# EAGLE board VSCard_v4 (EAGLE 8.3.1)
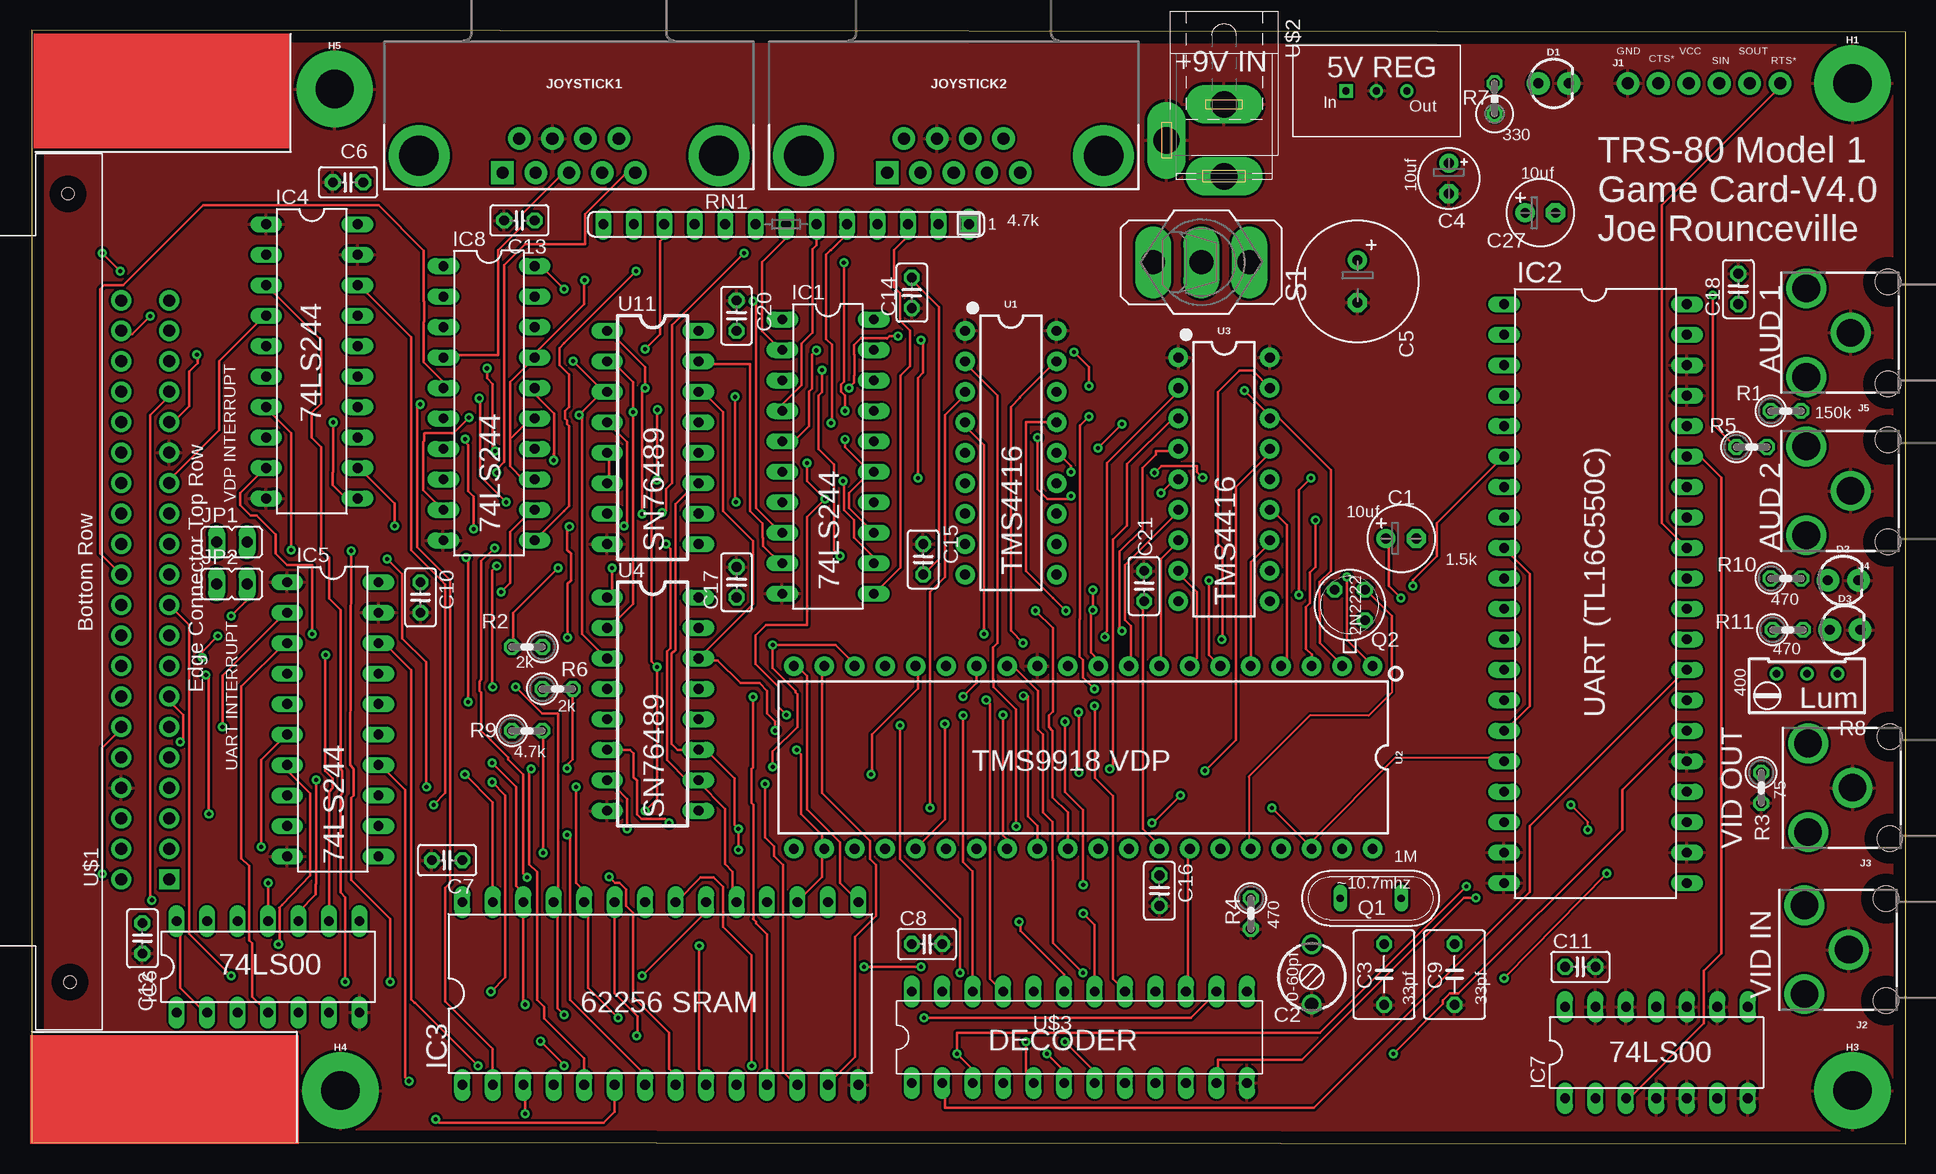
[diagram p2: board, top side]
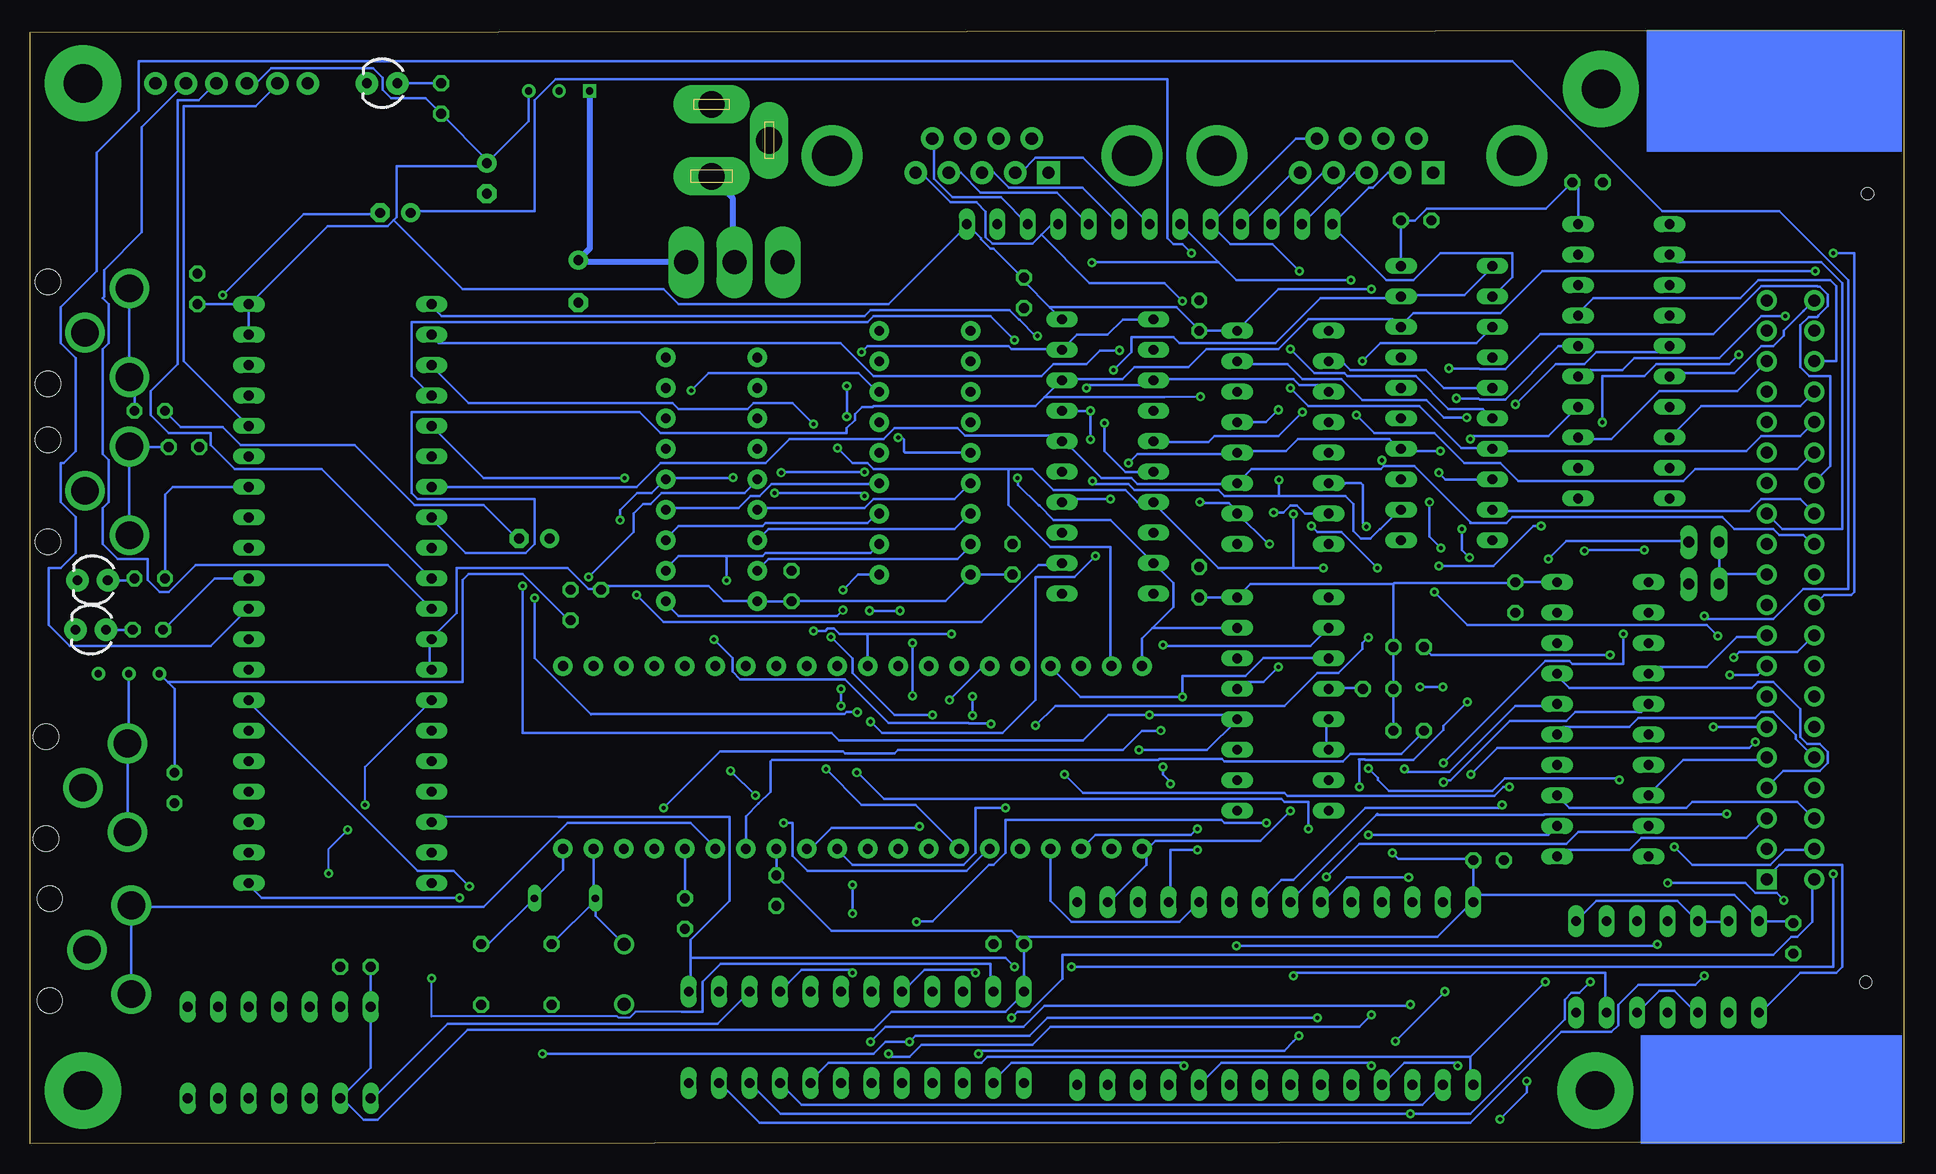
[diagram p3: board, bottom side, seen from below]

Size 156.19 x 92.86 mm. Coordinates in mm from the lower left corner, seen from the top.
Outline: 0,0.16 156.19,0 156.19,92.7 0,92.86 0,0.16
Copper layers (1*16): Top 0.035mm / dielectric 1.5mm / Bottom 0.035mm
Design rules "default": minimum track width 0.2mm, minimum drill 0.35mm, track to track 8mil, track to pad 8mil, pad to pad 8mil, via to via 8mil, smd to smd 8mil, copper to edge 40mil, drill to drill 6mil, minimum pad ring 10mil, minimum via ring 8mil, stop-mask expansion 4mil, vias tented up to drill 0mil, thermal gap 10mil

## Footprints (pad centres in the part's own frame; a part is rotated, then mirrored left to right if it is on the bottom)
E2,5-6 = drill 0.813 pad 1.6: + -1.27,0 | drill 0.813 pad 1.6 octagon: - 1.27,0
CTRIM3050.504 = drill 1.1: 1 -2.5,0; 2 2.5,0
C050-050X075 = drill 0.813 octagon: 1 -2.54,0; 2 2.54,0
E2,5-5 = drill 0.813 pad 1.6: + -1.27,0 | drill 0.813 pad 1.6 octagon: - 1.27,0
E3,5-10 = drill 0.813 pad 1.6: + -1.778,0 | drill 0.813 pad 1.6 octagon: - 1.778,0
C025-025X050 = drill 0.813 octagon: 1 -1.27,0; 2 1.27,0
LED_3MM = drill 0.813 pad 1.88: A -1.27,0; K 1.27,0
STANDOFF-ELECTRICAL = drill 3.2 pad 6.35: P1 0,0
DIL20 = drill 0.813 long: 1 -11.43,-3.81; 2 -8.89,-3.81; 3 -6.35,-3.81; 4 -3.81,-3.81; 5 -1.27,-3.81; 6 1.27,-3.81; 7 3.81,-3.81; 8 6.35,-3.81; 9 8.89,-3.81; 10 11.43,-3.81; 11 11.43,3.81; 12 8.89,3.81; 13 6.35,3.81; 14 3.81,3.81; 15 1.27,3.81; 16 -1.27,3.81; 17 -3.81,3.81; 18 -6.35,3.81; 19 -8.89,3.81; 20 -11.43,3.81
DIL40 = drill 0.813 long: 1 -24.13,-7.62; 2 -21.59,-7.62; 3 -19.05,-7.62; 4 -16.51,-7.62; 5 -13.97,-7.62; 6 -11.43,-7.62; 7 -8.89,-7.62; 8 -6.35,-7.62; 9 -3.81,-7.62; 10 -1.27,-7.62; 11 1.27,-7.62; 12 3.81,-7.62; 13 6.35,-7.62; 14 8.89,-7.62; 15 11.43,-7.62; 16 13.97,-7.62; 17 16.51,-7.62; 18 19.05,-7.62; 19 21.59,-7.62; 20 24.13,-7.62; 21 24.13,7.62; 22 21.59,7.62; 23 19.05,7.62; 24 16.51,7.62; 25 13.97,7.62; 26 11.43,7.62; 27 8.89,7.62; 28 6.35,7.62; 29 3.81,7.62; 30 1.27,7.62; 31 -1.27,7.62; 32 -3.81,7.62; 33 -6.35,7.62; 34 -8.89,7.62; 35 -11.43,7.62; 36 -13.97,7.62; 37 -16.51,7.62; 38 -19.05,7.62; 39 -21.59,7.62; 40 -24.13,7.62
DIL28-6 = drill 0.813 long: 1 -16.51,-7.62; 2 -13.97,-7.62; 3 -11.43,-7.62; 4 -8.89,-7.62; 5 -6.35,-7.62; 6 -3.81,-7.62; 7 -1.27,-7.62; 8 1.27,-7.62; 9 3.81,-7.62; 10 6.35,-7.62; 11 8.89,-7.62; 12 11.43,-7.62; 13 13.97,-7.62; 14 16.51,-7.62; 15 16.51,7.62; 16 13.97,7.62; 17 11.43,7.62; 18 8.89,7.62; 19 6.35,7.62; 20 3.81,7.62; 21 1.27,7.62; 22 -1.27,7.62; 23 -3.81,7.62; 24 -6.35,7.62; 25 -8.89,7.62; 26 -11.43,7.62; 27 -13.97,7.62; 28 -16.51,7.62
DIL14 = drill 0.813 long: 1 -7.62,-3.81; 2 -5.08,-3.81; 3 -2.54,-3.81; 4 0,-3.81; 5 2.54,-3.81; 6 5.08,-3.81; 7 7.62,-3.81; 8 7.62,3.81; 9 5.08,3.81; 10 2.54,3.81; 11 0,3.81; 12 -2.54,3.81; 13 -5.08,3.81; 14 -7.62,3.81
1X06_NO_SILK = drill 1.016 pad 1.88: 1 0,0; 2 2.54,0; 3 5.08,0; 4 7.62,0; 5 10.16,0; 6 12.7,0
RCA = drill 2.3: PIN 3.7,3.7; SHELL 0,0; SWITCH 3.7,-3.7 | hole 2.1: -3.1,4.25; -3.1,-4.25
DB9 = drill 1.016 pad 1.88 square: 1 -5.54,-1.42 | drill 1.016 pad 1.88: 2 -2.77,-1.42; 3 0,-1.42; 4 2.77,-1.42; 5 5.54,-1.42; 6 -4.15,1.42; 7 -1.38,1.42; 8 1.38,1.42; 9 4.15,1.42 | drill 3.302 pad 5.08: G1 -12.5,0; G2 12.5,0
JP1 = drill 0.914 long: 1 0,-1.27; 2 0,1.27
QS = drill 0.61 long: 1 -2.54,0; 2 2.54,0
TO18A = drill 0.813 octagon: B 1.27,-1.27; C 1.27,1.27; E -1.27,-1.27
0207/2V = drill 0.813 octagon: 1 -1.27,0; 2 1.27,0
0309V = drill 0.813 octagon: 1 -1.27,0; 2 1.27,0
RTRIM64W = drill 0.61: 1 1.27,-2.54; 2 1.27,0; 3 1.27,2.54
TRACON_REG = drill 0.6 square: P$1 0,0 | drill 0.6: P$2 2.54,0; P$3 5.08,0
SIL13 = drill 0.813 long: 1 -15.24,0; 2 -12.7,0; 3 -10.16,0; 4 -7.62,0; 5 -5.08,0; 6 -2.54,0; 7 0,0; 8 2.54,0; 9 5.08,0; 10 7.62,0; 11 10.16,0; 12 12.7,0; 13 15.24,0
320-916 = drill 2.007 long: 1 0,4.013; 2 0,0; 3 0,-4.013
DIP18 = drill 0.813 pad 1.626: 1 -10.16,-3.81; 2 -7.62,-3.81; 3 -5.08,-3.81; 4 -2.54,-3.81; 5 0,-3.81; 6 2.54,-3.81; 7 5.08,-3.81; 8 7.62,-3.81; 9 10.16,-3.81; 10 10.16,3.81; 11 7.62,3.81; 12 5.08,3.81; 13 2.54,3.81; 14 0,3.81; 15 -2.54,3.81; 16 -5.08,3.81; 17 -7.62,3.81; 18 -10.16,3.81
DIP40_MCU = drill 0.813 pad 1.626: P1 -24.13,-7.62; P2 -21.59,-7.62; P3 -19.05,-7.62; P4 -16.51,-7.62; P5 -13.97,-7.62; P6 -11.43,-7.62; P7 -8.89,-7.62; P8 -6.35,-7.62; P9 -3.81,-7.62; P10 -1.27,-7.62; P11 1.27,-7.62; P12 3.81,-7.62; P13 6.35,-7.62; P14 8.89,-7.62; P15 11.43,-7.62; P16 13.97,-7.62; P17 16.51,-7.62; P18 19.05,-7.62; P19 21.59,-7.62; P20 24.13,-7.62; P21 24.13,7.62; P22 21.59,7.62; P23 19.05,7.62; P24 16.51,7.62; P25 13.97,7.62; P26 11.43,7.62; P27 8.89,7.62; P28 6.35,7.62; P29 3.81,7.62; P30 1.27,7.62; P31 -1.27,7.62; P32 -3.81,7.62; P33 -6.35,7.62; P34 -8.89,7.62; P35 -11.43,7.62; P36 -13.97,7.62; P37 -16.51,7.62; P38 -19.05,7.62; P39 -21.59,7.62; P40 -24.13,7.62
DIP16 = drill 0.813 long: P1 -8.89,-3.81; P2 -6.35,-3.81; P3 -3.81,-3.81; P4 -1.27,-3.81; P5 1.27,-3.81; P6 3.81,-3.81; P7 6.35,-3.81; P8 8.89,-3.81; P9 8.89,3.81; P10 6.35,3.81; P11 3.81,3.81; P12 1.27,3.81; P13 -1.27,3.81; P14 -3.81,3.81; P15 -6.35,3.81; P16 -8.89,3.81
EBC20DRAS = drill 1 pad 1.676 square: P$1 0,0 | drill 1 pad 1.676: P$2 0,3.969; P$3 2.54,0; P$4 2.54,3.969; P$5 5.08,0; P$6 5.08,3.969; P$7 7.62,0; P$8 7.62,3.969; P$9 10.16,0; P$10 10.16,3.969; P$11 12.7,0; P$12 12.7,3.969; P$13 15.24,0; P$14 15.24,3.969; P$15 17.78,0; P$16 17.78,3.969; P$17 20.32,0; P$18 20.32,3.969; P$19 22.86,0; P$20 22.86,3.969; P$21 25.4,0; P$22 25.4,3.969; P$23 27.94,0; P$24 27.94,3.969; P$25 30.48,0; P$26 30.48,3.969; P$27 33.02,0; P$28 33.02,3.969; P$29 35.56,0; P$30 35.56,3.969; P$31 38.1,0; P$32 38.1,3.969; P$33 40.64,0; P$34 40.64,3.969; P$35 43.18,0; P$36 43.18,3.969; P$37 45.72,0; P$38 45.72,3.969; P$39 48.26,0; P$40 48.26,3.969 | hole 1: -8.572,8.255; 57.15,8.414
SPC4077 = drill 2.184 pad 2.184 long: 1 -3,0; 2 0,-4.8; 3 3,0
DIP24SKI = drill 0.813 pad 1.27 long: 1 -11.43,-3.81; 2 -8.89,-3.81; 3 -6.35,-3.81; 4 -3.81,-3.81; 5 -1.27,-3.81; 6 1.27,-3.81; 7 3.81,-3.81; 8 6.35,-3.81; 9 8.89,-3.81; 10 11.43,-3.81; 11 13.97,-3.81; 12 16.51,-3.81; 13 16.51,3.81; 14 13.97,3.81; 15 11.43,3.81; 16 8.89,3.81; 17 6.35,3.81; 18 3.81,3.81; 19 1.27,3.81; 20 -1.27,3.81; 21 -3.81,3.81; 22 -6.35,3.81; 23 -8.89,3.81; 24 -11.43,3.81

## Placement (x,y rotation side)
C1  10uf  [E2,5-6]  114.14,50.48 0 top
C2  0-60pf  [CTRIM3050.504]  106.68,14.13 270 top
C3  33pf  [C050-050X075]  112.71,14.13 90 top
C4  10uf  [E2,5-5]  118.11,80.49 270 top
C5  100uf  [E3,5-10]  110.49,71.91 270 top
C6  .1uf  [C025-025X050]  26.35,80.17 180 top
C7  .1uf  [C025-025X050]  34.61,23.65 180 top
C8  .1uf  [C025-025X050]  74.61,16.67 0 top
C9  33pf  [C050-050X075]  118.59,14.13 90 top
C10  .1uf  [C025-025X050]  32.39,45.56 270 top
C11  .1uf  [C025-025X050]  129.06,14.76 0 top
C12  .1uf  [C025-025X050]  9.21,17.14 270 top
C13  .1uf  [C025-025X050]  40.64,76.99 180 top
C14  .1uf  [C025-025X050]  73.34,70.96 270 top
C15  .1uf  [C025-025X050]  74.3,48.74 90 top
C16  .1uf  [C025-025X050]  93.98,21.11 270 top
C17  .1uf  [C025-025X050]  58.74,46.83 90 top
C18  .1uf  [C025-025X050]  142.24,71.28 90 top
C20  .1uf  [C025-025X050]  58.74,69.06 90 top
C21  .1uf  [C025-025X050]  92.71,46.51 90 top
C27  10uf  [E2,5-6]  125.73,77.63 0 top
D1  LED  [LED_3MM]  126.84,88.42 0 top
D2  LED  [LED_3MM]  150.97,46.99 0 top
D3  LED  [LED_3MM]  151.13,42.86 0 top
H1  STANDOFF_ELECTRICAL  [STANDOFF-ELECTRICAL]  151.77,88.42 0 top
H3  STANDOFF_ELECTRICAL  [STANDOFF-ELECTRICAL]  151.77,4.44 0 top
H4  STANDOFF_ELECTRICAL  [STANDOFF-ELECTRICAL]  25.72,4.44 0 top
H5  STANDOFF_ELECTRICAL  [STANDOFF-ELECTRICAL]  25.24,87.95 0 top
IC1  74LS244N  [DIL20]  66.36,57.31 270 top
IC2  16C550  [DIL40]  130.33,45.88 270 top
IC3  CY62256LL-PC  [DIL28-6]  52.39,12.54 0 top
IC4  74LS244N  [DIL20]  23.34,65.25 270 top
IC5  74LS244N  [DIL20]  25.08,35.4 270 top
IC6  74LS00N  [DIL14]  19.68,14.76 0 top
IC7  74LS00N  [DIL14]  135.41,7.62 0 top
IC8  74LS244N  [DIL20]  38.1,61.75 270 top
J1  SERIAL-TTL  [1X06_NO_SILK]  133.03,88.42 0 top
J2  RCA  [RCA]  151.45,16.19 180 top
J3  RCA  [RCA]  151.77,29.69 180 top
J4  RCA  [RCA]  151.61,54.45 180 top
J5  RCA  [RCA]  151.61,67.63 180 top
JOYSTICK1  Female  [DB9]  44.77,82.39 0 top
JOYSTICK2  Female  [DB9]  76.83,82.39 0 top
JP1  INT__VDP_JP  [JP1]  16.67,50.16 270 top
JP2  INT_UART_JP  [JP1]  16.67,46.67 270 top
Q1  10.738635mhz  [QS]  111.6,20.48 180 top
Q2  2N2222  [TO18A]  109.85,44.93 90 top
R1  150k  [0207/2V]  146.21,61.12 0 top
R2  2k  [0207/2V]  41.27,41.43 180 top
R3  75  [0207/2V]  144.15,29.69 270 top
R4  470  [0207/2V]  101.6,19.21 270 top
R5  150k  [0207/2V]  143.35,58.1 0 top
R6  2k  [0207/2V]  43.82,37.94 0 top
R7  330  [0309V]  121.92,87.15 90 top
R8  400  [RTRIM64W]  147.96,37.94 90 top
R9  4.7k  [0207/2V]  41.27,34.45 0 top
R10  470  [0207/2V]  146.21,47.15 0 top
R11  470  [0207/2V]  146.37,42.86 0 top
REG1  TRS2-2450  [TRACON_REG]  109.54,87.79 0 top
RN1  4.7k  [SIL13]  62.87,76.68 180 top
S1  ON/OFF  [320-916]  97.47,73.5 270 top
U1  TMS4416  [DIP18]  81.6,57.63 270 top
U2  TMS9118  [DIP40_MCU]  87.63,32.23 180 top
U3  TMS4416  [DIP18]  99.38,55.4 270 top
U4  SN76489  [DIP16]  51.75,36.67 270 top
U11  SN76489  [DIP16]  51.75,58.9 270 top
U$1  EBC20DRAS  [EBC20DRAS]  11.43,22.07 90 top
U$2  SPC4077_LARGE_HOLES  [SPC4077]  99.38,83.66 270 top
U$3  TRS80GS_DECODER  [DIP24SKI]  84.77,8.89 0 top

## Tracks (layer width: path | path; a pad name or v marks a point on that pad's centre or on a via)
A0_BUFFERED  (via drill 0.35)
  Top 0.2: 53.73,20.2 53.87,20.27 | 53.73,20.2 IC3.21 | IC4.18 27.36,71.52 31.61,67.27 31.61,49.52 34.12,47.02 34.12,47.01 34.46,46.66 34.46,29.26 v33.48,28.27 | IC2.28 137.87,39.52 124.86,26.52 124.86,21.02 106.86,3.02 76.11,3.02 76.11,5.02 U$3.2 | 53.73,20.2 55.76,22.22 56.83,22.22 57.63,21.43 57.63,18.1 60.01,15.72 v60.01,6.51
  Bottom 0.2: U$3.2 75.86,5.27 74.36,6.77 60.27,6.77 v60.01,6.51 | IC3.21 53.62,20.27 51.87,22.02 50.87,22.02 44.87,28.02 33.73,28.02 v33.48,28.27
A0_RAW
  Bottom 0.2: IC4.2 19.36,74.02 18.86,73.52 6.87,73.52 5.12,71.77 5.12,51.27 10.12,51.27 11.37,52.52 U$1.P$25
A1_BUFFERED  (via drill 0.35)
  Top 0.2: IC3.23 48.62,20.02 48.58,19.99 48.58,12.54 50.48,10.64 50.48,9.1 v50.41,9.02 | U$3.3 78.36,5.27 78.36,6.27 v77.11,7.52 77.11,9.27 107.36,9.27 v119.57,21.48 | v39.53,53.5 37.37,55.66 37.37,62.09 v37.29,62.16 | v38.58,49.69 37.47,48.58 37.47,38.73 37.31,38.58 37.31,37.78 37.47,37.62 37.47,34.45 38.24,33.67 39.69,32.23 39.69,32.07 40.96,30.8 40.96,30.18 | 40.96,30.18 | 40.96,30.18 40.96,22.55 v41.27,22.23
  Bottom 0.2: v77.11,7.52 76.86,7.77 51.64,7.77 50.87,8.54 50.87,8.57 v50.41,9.02 | IC3.23 48.37,20.27 46.41,22.23 v41.27,22.23 | v119.57,21.48 120.86,22.77 123.86,22.77 137.87,36.77 IC2.27 | v39.53,53.5 39.53,50.64 v38.58,49.69 | v37.29,62.16 35.45,62.16 35.35,62.06 33.23,62.06 28.77,66.52 IC4.16
A1_RAW
  Top 0.2: IC4.4 19.36,69.02 15.62,65.27 15.62,59.52 11.62,55.52 11.62,55.27 U$1.P$27
A2_BUFFERED  (via drill 0.35)
  Top 0.2: v45.37,29.77 45.37,21.77 45.87,21.27 45.87,20.27 IC3.24 46.37,20.02 46.37,13.02 v48.87,10.52 | v36.12,58.77 36.12,58.5 36.35,58.26 36.35,54.45 36.83,53.97 v36.83,51.28 | v36.37,36.85 36.37,48.72 v36.2,48.89 | v82.86,8.52 82.86,6.02 83.36,5.52 U$3.5 | 137.87,34.02 IC2.26 137.48,34.45 132.56,29.53 132.56,26.19 118.91,12.55 118.19,12.55 117.62,11.99 117.62,11.67 v113.48,7.52
  Bottom 0.2: v36.12,58.77 35.87,59.02 29.61,59.02 27.36,61.27 IC4.14 | v36.83,51.28 36.83,49.53 v36.2,48.89 | v36.37,36.85 38.37,34.85 38.37,34.52 40.87,32.02 44.87,32.02 44.91,32.07 45.4,32.07 45.37,32.03 v45.37,29.77 | v48.87,10.52 71.36,10.52 72.86,9.02 82.36,9.02 v82.86,8.52 84.86,8.52 85.86,7.52 v113.48,7.52
A2_RAW
  Bottom 0.2: IC4.6 19.36,64.02 19.11,64.27 14.12,64.27 11.87,66.52 10.87,66.52 10,67.39 10,67.79 8.33,69.45 | 8.36,69.43 8.33,69.45 | 8.33,69.45 U$1.P$40
A3_BUFFERED  (via drill 0.35)
  Top 0.2: v84.61,7.52 85.86,6.27 85.86,5.27 U$3.6 | 43.56,20.09 43.62,20.02 43.87,19.77 43.87,35.83 43.82,35.88 42.55,35.88 v40.32,38.1 | 43.56,20.09 IC3.25 | IC4.12 27.36,56.27 30.23,53.41 v30.23,51.52 | v38.42,38.1 38.37,38.15 38.37,47.8 v38.75,48.18 | 43.56,20.09 43.82,19.83 43.82,11.32 v44.37,10.77
  Bottom 0.2: v44.37,10.77 45.37,9.77 71.11,9.77 72.61,8.27 81.86,8.27 82.86,7.27 84.36,7.27 v84.61,7.52 | v38.42,38.1 v40.32,38.1 | v38.75,48.18 34.22,48.18 34.21,48.17 30.86,51.52 v30.23,51.52
A3_RAW
  Bottom 0.2: IC4.8 19.36,59.02 16.86,61.52 8.62,61.52 7.62,62.52 U$1.P$34
A4_BUFFERED  (via drill 0.35)
  Top 0.2: v86.11,8.52 88.36,6.27 88.36,5.27 U$3.7 | v23.36,42.52 23.36,48.27 21.26,48.27 20.32,49.21 20.32,50.8 18.73,52.39 18.25,52.39 17.36,53.27 17.36,54.27 19.36,56.27 IC4.9 | v38.37,31.77 40.37,29.77 40.37,21.52 40.87,21.02 40.87,20.27 IC3.26 40.96,11.78 v41.12,11.62
  Bottom 0.2: v86.11,8.52 84.86,9.77 73.36,9.77 71.61,11.52 41.21,11.52 v41.12,11.62 | v23.36,42.52 23.36,40.02 27.61,40.02 27.86,40.27 29.86,40.27 v38.37,31.77
A4_RAW  (via drill 0.35)
  Top 0.2: v25.11,60.16 25.11,56.02 25.08,55.99 25.08,54.93 26.19,53.82 IC4.11 | U$1.P$31 11.62,60.02 13.12,61.52 13.12,64.39 13.81,65.09 13.81,65.76 v13.75,65.82
  Bottom 0.2: v25.11,60.16 25.11,64.02 21.61,64.02 20.61,65.02 14.55,65.02 v13.75,65.82
A5_BUFFERED  (via drill 0.35)
  Top 0.2: v21.61,49.52 21.61,59.27 19.61,61.27 IC4.7 | v29.86,13.52 29.86,18.77 26.61,22.02 26.61,28.84 26.83,29.05 26.83,31.27 26.51,31.59 v26.61,49.44 v26.61,49.45
  Bottom 0.2: 36.12,7.27 36.12,5.02 IC3.1 | 36.12,7.27 76.36,7.27 76.86,6.77 89.61,6.77 91.11,5.27 U$3.8 | 36.12,7.27 v29.86,13.52 | v21.61,49.52 26.54,49.52 v26.61,49.45
A5_RAW
  Bottom 0.2: IC4.13 27.11,58.77 24.36,58.77 20.36,62.77 13.87,62.77 11.62,65.02 U$1.P$35
A6_BUFFERED  (via drill 0.35)
  Top 0.2: IC3.2 38.42,7.94 34.45,11.91 34.45,21.36 34.87,21.77 34.87,47.02 32.12,49.77 32.12,61.41 v32.37,61.66
  Bottom 0.2: IC3.2 38.62,4.77 40.12,3.27 91.86,3.27 93.61,5.02 U$3.9 | IC4.5 19.61,66.27 19.86,66.02 25.61,66.02 26.61,65.02 29,65.02 v32.37,61.66
A6_RAW  (via drill 0.35)
  Top 0.2: v9.87,69.02 8.37,67.52 7.62,67.52 7.62,67.77 U$1.P$38
  Bottom 0.2: v9.87,69.02 11.87,69.02 15.37,65.52 22.45,65.52 23.45,64.52 26.61,64.52 27.11,64.02 IC4.15
A7_BUFFERED  (via drill 0.35)
  Top 0.2: v41.12,2.52 41.12,4.77 IC3.3 | IC4.3 19.61,71.52 24.11,67.02 24.11,61.74 23.34,60.96 23.34,58.9 24.13,58.1 24.13,49.53 24.76,48.89 24.76,45.46 25.72,44.5 25.72,31.27 25.88,31.11 25.88,29.21 25.72,29.05 25.72,20.95 26.11,20.56 v26.11,13.52
  Bottom 0.2: v26.11,13.52 27.06,12.58 27.7,12.58 28.27,12.01 28.27,10.37 36.12,2.52 v41.12,2.52 93.65,2.52 U$3.10
A7_RAW
  Bottom 0.2: IC4.17 27.11,69.27 25.86,70.52 13.62,70.52 12.12,72.02 6.12,72.02 5.62,71.52 5.62,65.27 7.37,65.27 U$1.P$36
A8_BUFFERED  (via drill 0.35)
  Top 0.2: IC5.18 29.11,41.52 29.61,41.52 31.61,39.52 31.61,12.07 31.91,11.77 31.93,11.77 v37.18,6.52
  Bottom 0.2: 37.2,6.77 37.12,6.77 | 37.2,6.77 41.62,6.77 43.37,5.02 IC3.4 | v37.18,6.52 37.18,6.75 37.2,6.77
A8_RAW  (via drill 0.35)
  Top 0.2: IC5.2 21.11,44.27 15.88,39.04 v15.88,34.77
  Bottom 0.2: U$1.P$11 11.62,34.77 v15.88,34.77
A9_BUFFERED  (via drill 0.35)
  Top 0.2: v41.62,31.27 41.46,31.11 41.46,23.32 42.12,22.66 42.12,12.02 42.7,11.43 42.7,10.48 46.04,7.14 IC3.5
  Bottom 0.2: v41.62,31.27 41.37,31.02 37.87,31.02 32.37,36.52 29.11,36.52 IC5.16
A9_RAW
  Bottom 0.2: IC5.4 21.11,39.27 20.61,39.77 16.43,39.77 13.93,42.27 11.62,42.27 U$1.P$17
A10_BUFFERED  (via drill 0.35)
  Top 0.2: IC5.14 29.11,31.52 31.11,29.52 31.11,5.56 v31.43,5.24 | v33.66,2.06 33.95,1.77 47.65,1.77 48.58,2.7 IC3.6
  Bottom 0.2: v31.43,5.24 31.43,4.29 v33.66,2.06
A10_RAW  (via drill 0.35)
  Top 0.2: v19.11,24.77 19.11,32.02 21.11,34.02 IC5.6
  Bottom 0.2: v19.11,24.77 17.61,23.27 11.12,23.27 9.87,24.52 7.62,24.52 U$1.P$4
A11_BUFFERED  (via drill 0.35)
  Top 0.2: v44.62,25.77 44.87,25.52 44.87,12.02 51.12,5.77 51.12,5.02 IC3.7
  Bottom 0.2: v44.62,25.77 29.61,25.77 29.11,26.27 IC5.12
A11_RAW
  Bottom 0.2: IC5.8 21.11,29.27 18.36,32.02 11.62,32.02 U$1.P$9
A12_BUFFERED  (via drill 0.35)
  Top 0.2: IC3.8 53.62,5.02 53.62,5.77 53.12,6.27 53.12,9.27 50.12,12.27 50.12,19.26 49.54,19.83 49.54,21.22 48.98,21.79 48.6,21.79 v48.12,22.27
  Bottom 0.2: v48.12,22.27 45.37,25.02 28.11,25.02 27.11,26.02 21.61,26.02 21.36,26.27 IC5.9
A12_RAW
  Bottom 0.2: IC5.11 28.86,24.02 28.36,24.52 22.86,24.52 21.86,25.52 13.12,25.52 11.62,27.02 U$1.P$5
A13_BUFFERED  (via drill 0.35)
  Top 0.2: IC3.9 56.12,5.02 56.12,5.77 55.62,6.27 55.62,16.5 v55.64,16.52 | IC5.7 21.43,31.43 21.43,30.96 23.18,29.21 23.18,22.38 20.86,19.93 20.86,19.91 20.62,19.66 20.65,19.63 20.65,16.74 v20.55,16.64
  Bottom 0.2: v20.55,16.64 20.66,16.52 v55.64,16.52
A13_RAW
  Bottom 0.2: IC5.13 27.86,28.02 18.11,28.02 17.61,28.52 8.87,28.52 7.62,27.27 U$1.P$6
A14_BUFFERED  (via drill 0.35)
  Top 0.2: v44.37,6.52 44.37,6.59 v42.39,8.57 | v38.36,30.16 39.46,29.07 39.46,13.87 38.28,12.7 v38.26,12.7
  Bottom 0.2: v44.37,6.52 44.62,6.77 56.87,6.77 58.62,5.02 IC3.10 | IC5.5 21.36,36.52 21.86,36.02 27.36,36.02 28.11,35.27 32.83,35.27 37.78,30.32 38.2,30.32 v38.36,30.16 | v42.39,8.57 v38.26,12.7
A14_RAW
  Bottom 0.2: 10.93,36.02 10.87,36.02 | 10.93,36.02 11.87,36.02 12.37,35.52 22.11,35.52 22.86,34.77 28.36,34.77 28.86,34.27 IC5.15 | 10.93,36.02 9.02,34.11 9.02,33.78 U$1.P$10
A15_BUFFERED
  Top 0.2: IC6.4 18.36,12.27 18.36,16.72 18.1,16.99 18.1,17.5 18.11,17.51 18.11,23.17 17.46,23.81 17.46,38.12 21.11,41.77 IC5.3
A15_RAW
  Bottom 0.2: IC5.17 28.86,39.02 27.86,38.02 12.68,38.02 12.18,38.52 10.87,38.52 8.62,36.27 8.62,33.95 8.03,33.37 6.99,33.37 6.32,32.7 6.32,31.75 6.99,31.08 10.05,31.08 11.37,29.77 U$1.P$7
COMVID
  Top 0.152: U2.P36 101.44,24.76 101.44,30.64 106.52,35.72 111.44,35.72 113.36,37.64 113.36,39.02
  Top 0.2: 113.36,39.02 113.36,44.02 111.36,46.02 Q2.B | U2.P36 101.36,24.77
  Bottom 0.2: R4.1 U2.P36
COMVID-OUT
  Bottom 0.2: R3.1 144.15,37.94 144.67,38.47 | 144.67,38.47 R8.3 | Q2.E 111.36,43.77 115.11,47.52 119.61,47.52 120.11,47.02 120.11,38.52 144.62,38.52 144.67,38.47
CTS*
  Bottom 0.2: IC2.36 138.12,60.02 143.37,65.27 143.37,86.52 137.37,86.52 135.62,88.27 J1.2
D0  (via drill 0.35)
  Top 0.2: 47.62,62.77 47.87,62.52 U11.P3 47.62,62.77 | 47.62,62.77 v45.12,65.27 | 47.62,62.77 45.87,61.02 | 45.87,61.02 45.87,42.52 47.87,40.52 U4.P3 | 45.87,61.02 v45.62,60.77 | v60.12,37.27 60.12,31.38 60.01,31.27 60.01,28.42 60.17,28.26 60.17,18.82 60.12,18.77 60.37,18.52 60.37,18.37 61.28,17.46 IC3.11 | 72.23,67.33 v72.2,67.36 71.49,67.36 71.26,67.13 71.23,67.16 69.11,67.16 68.54,66.6 68.54,65.8 68.58,65.76 68.58,64.09 68.54,64.06 68.54,63.45 v68.11,63.02
  Bottom 0.2: U4.P3 48.12,40.52 53.37,40.52 54.87,39.02 60.12,39.02 v60.12,37.27 68.61,37.27 71.11,39.77 U2.P17 | U11.P3 48.12,62.77 48.62,63.27 50.37,63.27 50.87,63.77 62.37,63.77 IC1.3 62.62,63.52 62.87,63.27 67.86,63.27 v68.11,63.02 | v45.12,65.27 43.62,66.77 35.62,66.77 34.37,68.02 IC8.3 | IC2.1 122.61,69.77 121.86,69.02 86.61,69.02 86.11,69.52 74.54,69.52 73.74,68.73 73.72,68.73 72.36,67.36 v72.2,67.36 | v45.62,60.77 44.12,59.27 39.12,59.27 36.62,56.77 33.62,56.77 32.12,55.27 18.36,55.27 17.36,56.27 8.87,56.27 7.62,57.52 U$1.P$30
D1  (via drill 0.35)
  Top 0.2: U11.P2 48.12,65.02 48.62,65.02 50.12,63.52 v50.12,61.02 50.12,45.02 48.12,43.02 U4.P2 | 62.59,58.7 62.62,58.77 | 62.59,58.7 IC1.5 62.55,58.9 | IC3.12 63.62,5.02 62.62,6.02 62.62,23.27 61.87,24.02 61.87,24.81 61.12,25.56 v61.12,30 | 61.87,31.54 v61.75,31.43 61.75,32.7 63.82,34.77 63.82,37.46 63.66,37.62 63.66,37.78 61.75,39.69 v61.75,41.59 66.99,41.59 68.58,40 U2.P18 | v65.39,66.16 65.02,65.79 65.02,62.95 64.77,62.71 64.77,59.85 63.66,58.74 62.63,58.74 62.59,58.7 | IC8.5 34.29,63.54 32.67,65.16 32.67,68.5 32.7,68.54 32.7,70.21 32.67,70.24 32.67,74.49 28.89,78.26 14.29,78.26 7.62,71.6 6.03,71.6 5.71,71.28 5.71,49.21 U$1.P$22
  Bottom 0.2: IC8.5 38.32,63.02 39.82,64.52 46.12,64.52 46.62,65.02 47.87,65.02 U11.P2 | v50.12,61.02 52.12,59.02 57.48,59.02 57.98,58.52 62.37,58.52 IC1.5 | IC2.2 122.61,67.27 122.11,66.77 88.61,66.77 85.86,64.02 71.86,64.02 70.86,65.02 68.15,65.02 67.01,66.16 v65.39,66.16 | v61.12,30 61.12,30.16 61.75,30.8 v61.75,31.43 | v61.75,41.59 61.91,41.59 61.84,41.52 49.44,41.52 U4.P2
D2  (via drill 0.35)
  Top 0.2: U11.P1 48.12,67.77 51.12,64.77 v51.12,63.02 50.87,62.77 v50.87,52.52 | IC3.13 66.36,5.02 68.61,7.27 68.61,17.27 70.36,19.02 70.36,23.27 69.86,23.77 69.86,25.28 65.86,29.28 65.86,39.77 U2.P19 | v48.37,48.02 48.37,46.02 48.12,45.77 U4.P1 | v88.86,58.02 v90.86,60.02
  Bottom 0.2: U$1.P$32 7.62,60.02 8.62,59.02 11.87,59.02 13.12,57.77 34.12,57.77 IC8.7 34.37,58.02 36.87,58.02 40.37,61.52 49.62,61.52 v51.12,63.02 | 50.87,48.02 57.12,48.02 62.37,53.27 IC1.7 62.62,53.52 63.87,53.52 64.86,54.52 70.86,54.52 72.61,56.27 74.61,56.27 | 50.87,48.02 v48.37,48.02 | v90.86,60.02 92.61,61.77 95.86,61.77 96.36,61.27 102.11,61.27 102.61,61.77 119.61,61.77 122.61,64.77 IC2.3 | v88.86,58.02 87.61,56.77 86.36,56.77 85.86,56.27 74.61,56.27 | 74.61,56.27 74.61,53.27 71.11,49.77 66.11,49.77 66.11,40.02 U2.P19 | 50.87,48.02 v50.87,52.52
D3  (via drill 0.35)
  Top 0.2: IC3.15 68.86,20.27 67.36,21.77 67.36,25.12 64.61,27.87 64.61,39.02 63.62,40.02 U2.P20 | U11.P15 55.62,65.02 59.87,65.02 59.87,52.78 60.92,51.72 60.92,50.56 60.96,50.52 60.96,49.85 62.39,48.42 IC1.9 62.37,48.52 | IC8.9 34.12,53.02 32.62,54.52 32.62,58.52 32.7,58.61 32.7,59.21 32.76,59.27 35.14,59.27 v36.43,60.57 | v73.86,55.52 73.86,63.86 74.3,64.29 74.3,66.84 v74.11,67.02
  Bottom 0.2: IC8.9 34.12,52.77 12.87,52.77 11.87,53.77 8.62,53.77 7.62,52.77 U$1.P$26 | v74.11,67.02 76.11,69.02 85.86,69.02 86.36,68.52 124.36,68.52 124.36,64.02 122.86,62.52 IC2.4 | 72.05,53.21 70.86,52.02 66.11,52.02 62.62,48.52 IC1.9 62.37,48.27 60.87,46.77 60.87,44.78 62.63,43.02 | 72.05,53.21 72.11,53.27 | U11.P15 55.37,65.02 51.37,65.02 50.12,63.77 46.87,63.77 45.12,62.02 39.8,62.02 38.34,60.57 v36.43,60.57 | U2.P20 63.5,42.15 62.63,43.02 | U4.P15 62.63,43.02 | 72.05,53.21 72.1,53.21 73.82,54.93 73.82,55.48 v73.86,55.52
D4  (via drill 0.35)
  Top 0.2: 70.11,48.52 IC1.12 70.17,48.94 68.54,50.56 68.54,52.02 67.71,52.86 67.71,55.18 v67.61,55.27 | v106.61,55.52 105.61,54.52 v105.61,45.77 | v39.12,46.02 39.87,46.77 39.87,51.02 41.87,53.02 IC8.12 | v51.12,27.77 52.12,28.77 v52.12,39.77 51.66,40.23 51.66,54.93 v52.09,55.36 52.09,61.15 v52.14,61.2 | v14.18,40.55 14.18,41.02 v15.5,42.34
  Bottom 0.2: 63.12,24.52 63.12,23.27 66.11,20.27 IC3.16 | 63.12,24.52 63.37,24.52 U2.P21 63.12,24.52 | IC8.12 42.12,52.77 43.61,51.28 43.66,51.28 44.45,50.48 45.24,50.48 45.88,51.12 45.88,53.34 46.56,54.02 52.1,54.02 | v52.12,39.77 53.37,38.52 54.87,38.52 55.37,38.02 U4.P13 | v67.61,55.27 67.36,55.02 64.61,55.02 64.11,54.52 57.12,54.52 56.62,54.02 52.1,54.02 | v106.61,55.52 118.36,55.52 122.61,59.77 IC2.5 | v105.61,45.77 103.36,43.52 76.86,43.52 72.11,48.27 70.36,48.27 IC1.12 | v39.12,46.02 36.37,43.27 16.44,43.27 v15.5,42.34 | U$1.P$18 7.62,42.27 8.87,41.02 13.71,41.02 v14.18,40.55 | 63.12,24.52 62.37,25.27 53.62,25.27 v51.12,27.77 | U11.P13 53.18,60.17 v52.14,61.2 | v52.09,55.36 52.09,54.04 52.1,54.02
D5  (via drill 0.35)
  Top 0.2: v64.61,56.77 64.61,55.27 v66.11,53.77 64.61,52.27 64.61,43.27 61.21,43.27 60.33,42.39 60.33,40 62.23,38.1 62.23,36.43 v62.89,35.77 | IC3.17 63.87,20.27 65.86,22.27 65.86,24.52 U2.P22 65.86,24.77 65.86,25.77 64.11,27.52 64.11,32.48 v63.75,32.84 | v115.11,46.52 115.11,47.02 117.11,49.02 117.11,51.77 122.61,57.27 IC2.6 | v37.93,64.66 37.93,63.83 38.42,63.34 38.42,57.97 v38.62,57.77
  Bottom 0.2: v66.11,53.77 69.86,53.77 70.11,53.52 IC1.14 | v64.61,56.77 63.87,57.52 55.62,57.52 U11.P12 55.37,57.77 51.5,57.77 50.5,58.77 42.87,58.77 42.12,58.02 IC8.14 41.87,57.77 v38.62,57.77 | U$1.P$28 7.37,55.27 6.12,56.52 6.12,64.02 7.87,64.02 8.62,64.77 8.62,68.25 7.93,68.93 7.21,68.93 7.12,69.02 7.12,69.06 6.32,69.85 6.32,70.8 6.99,71.47 7.17,71.47 7.22,71.52 11.87,71.52 15.87,67.52 30.31,67.52 33.23,64.6 35.35,64.6 35.41,64.66 v37.93,64.66 | 55.6,35.31 55.62,35.27 | 55.6,35.31 U4.P12 55.59,35.47 | v115.11,46.52 115.11,34.27 89.36,34.27 88.75,33.65 68.42,33.65 66.3,35.77 v62.89,35.77 55.9,35.77 55.59,35.47 | 55.59,35.47 55.62,35.52 | v63.75,32.84 58.07,32.84 55.6,35.31
D6  (via drill 0.35)
  Top 0.2: 55.62,32.77 U4.P11 | v58.89,24.52 v58.89,26.27 58.58,26.58 58.58,30.48 56.2,32.86 U4.P11 | 55.37,55.02 U11.P11 55.4,55.09 53.66,53.34 53.66,41.19 53.34,40.87 53.34,33.34 53.82,32.86 U4.P11 | IC8.16 41.91,62.51 43.53,60.88 43.53,57.54 | 43.5,57.51 43.53,57.54 | 43.53,57.54 43.53,57.03 v43.5,56.99
  Bottom 0.2: U2.P23 68.36,24.77 67.36,25.77 59.87,25.77 59.41,25.77 58.91,26.27 v58.89,26.27 | v58.89,24.52 61.12,24.52 61.12,20.27 IC3.18 | IC2.7 122.61,54.77 105.61,54.77 103.61,56.77 94.86,56.77 92.86,58.77 85.05,58.77 84.14,59.69 78.89,59.69 78.25,59.05 70.64,59.05 70.36,58.77 IC1.16 70.11,58.52 69.86,58.52 66.86,55.52 64.36,55.52 63.87,55.02 55.62,55.02 U11.P11 55.37,55.27 54.37,56.27 43.58,56.27 43.34,56.51 | U$1.P$24 7.62,50.02 8.37,50.77 10.37,50.77 10.87,51.27 14.12,51.27 15.12,52.27 32.62,52.27 33.12,51.77 36.12,51.77 36.12,51.83 40.8,56.51 43.34,56.51 | v43.5,56.99 43.5,56.67 43.34,56.51
D7  (via drill 0.35)
  Top 0.2: 58.62,20.27 IC3.19 58.42,20.48 58.42,22.7 57.79,23.34 57.79,27.94 55.56,30.16 U4.P10 55.62,30.27 U4.P10 54.61,30.32 52.94,31.99 52.94,41.04 53.25,41.36 53.25,49.62 v52.86,50.01 | 58.62,53.86 v58.62,62.29 | 58.62,53.86 58.62,53.77 | v7.37,72.77 v5.87,74.27 | v58.68,53.52 58.68,53.8 58.62,53.86
  Bottom 0.2: IC3.19 58.87,20.02 60.37,18.52 69.36,18.52 71.11,20.27 71.11,24.52 U2.P24 | 71.61,62.27 70.36,63.52 IC1.18 70.11,63.77 65.14,63.77 64.14,64.77 59.64,64.77 58.14,66.27 52.12,66.27 49.62,68.77 42.62,68.77 42.12,68.27 IC8.18 41.87,68.27 40.87,69.27 33.62,69.27 30.11,72.77 v7.37,72.77 | 71.61,62.27 72.36,61.52 85.86,61.52 85.95,61.44 86.84,61.44 87.42,60.85 87.42,60.36 88.11,59.67 88.11,59.27 103.61,59.27 105.36,61.02 124.36,61.02 124.36,54.27 123.86,53.77 114.11,53.77 114.11,50.02 114.86,49.27 119.86,49.27 122.61,52.02 IC2.8 | v58.62,62.29 61.62,62.27 71.61,62.27 | 55.58,52.62 55.62,52.77 56.27,53.43 58.59,53.43 v58.68,53.52 | 55.58,52.62 U11.P10 55.37,52.52 | v5.87,74.27 4.12,74.27 4.12,46.02 4.37,45.77 6.62,45.77 7.37,45.02 U$1.P$20 | v52.86,50.01 52.97,50.01 55.58,52.62
DOWN
  Top 0.2: IC8.4 34.37,65.77 38.87,65.77 38.87,74.52 40.87,76.52 40.87,77.52 44.12,80.77 44.62,80.77 JOYSTICK1.3
  Bottom 0.2: RN1.12 47.11,79.73 47.02,79.73 45.78,80.97 JOYSTICK1.3
DOWN1
  Top 0.2: 65.36,75.77 65.36,76.52 RN1.6 65.41,74.93 65.09,74.61 65.09,67.63 64.17,66.71 64.17,63.26 64.16,63.25 62.55,61.64 IC1.4 62.62,61.27
  Bottom 0.2: JOYSTICK2.3 75.82,80.97 74.58,79.73 68.46,79.73 RN1.6
GND
  pour Top: 0,0.48 156.21,0.48 156.21,92.87 0,92.87
IN*  (via drill 0.35)
  Top 0.2: v16.61,14.02 13.12,17.52 13.12,43.27 11.62,44.77 U$1.P$19 | v120.36,20.52 119.36,20.52 105.86,7.02 98.86,7.02 98.86,5.52 U$3.11
  Bottom 0.2: v16.61,14.02 17.36,13.27 22.11,13.27 23.8,11.59 23.8,9.89 24.37,9.33 28.56,9.33 36.12,1.77 95.36,1.77 98.61,5.02 U$3.11 | v120.36,20.52 136.87,20.52 137.87,21.52 IC2.21
INT*
  Bottom 0.2: 15.37,47.52 15.37,50.02 JP1.1 | 15.37,47.52 15.37,46.77 JP2.1 15.37,47.52 | 15.37,47.52 11.62,47.52 U$1.P$21
JOY1_IN_ENABLE_N  (via drill 0.35)
  Top 0.2: v86.11,35.2 86.11,29.37 87.61,27.87 87.61,21.6 v87.63,21.59 | v67.36,49.02 66.86,49.52 66.86,56.62 65.56,57.93 65.56,57.94 65.56,62.39 65.86,62.69 v65.86,64.52 | U$3.18 88.58,18.26 v87.63,19.21
  Bottom 0.2: v67.36,49.02 69.11,47.27 72.36,47.27 72.36,37.02 75.11,34.27 85.19,34.27 v86.11,35.2 | v65.86,64.52 64.36,66.02 64.36,67.27 60.89,67.27 60.39,66.77 52.37,66.77 48.62,70.52 42.12,70.52 IC8.19 41.87,70.77 36.62,70.77 34.37,73.02 IC8.1 | v87.63,21.59 v87.63,19.21
JOY1_IN_ENABLE_N1  (via drill 0.35)
  Top 0.2: v86.86,66.02 88.11,64.77 v88.11,63.19 v88.11,63.18 | U$3.17 91.11,12.77 90.11,13.77 90.11,29.02 88.61,30.52 88.61,36.48 v88.58,36.51 | v88.11,60.64 v88.11,60.63 88.11,60.63 87.36,59.88 87.36,43.77 87.31,43.72 87.31,40.64 87.61,40.34 87.61,38.91 v88.58,37.94
  Bottom 0.2: v86.86,66.02 86.36,66.52 74.61,66.52 74.36,66.27 70.36,66.27 IC1.19 70.11,66.27 68.92,67.47 66.36,67.47 65.09,68.74 IC1.1 | v88.11,63.18 v88.11,60.64 | v88.58,37.94 v88.58,36.51
LEFT  (via drill 0.35)
  Top 0.2: v51.12,66.27 52.37,67.52 52.37,75.27 52.62,75.52 52.62,76.52 RN1.11
  Bottom 0.2: JOYSTICK1.4 48.41,80.97 RN1.11 | v51.12,66.27 49.12,64.27 46.62,64.27 46.37,64.02 40.69,64.02 37.94,61.28 35.08,61.28 IC8.6
LEFT1  (via drill 0.35)
  Top 0.2: RN1.5 67.86,76.52 67.86,75.77 66.61,74.52 66.59,74.52 66.2,74.14 66.2,67.11 66.67,66.63 66.67,60.15 v66.61,60.09
  Bottom 0.2: RN1.5 70.59,79.32 76.95,79.32 78.59,80.97 JOYSTICK2.4 | IC1.6 62.62,56.02 64.86,56.02 66.61,57.77 v66.61,60.09
N$1
  Bottom 0.2: 147.91,58.08 J4.PIN | 147.91,58.08 J4.SWITCH | R5.2 147.89,58.1 147.91,58.08
N$2
  Bottom 0.508: U$2.3 99.38,80.64 97.63,78.9 97.63,73.66 S1.2
N$3  (via drill 0.35)
  Top 0.2: v29.61,48.77 30.86,47.52 30.86,42.16 32.86,40.16 32.86,29.8 v32.89,29.77 | U2.P16 73.86,39.77 73.86,37.99 70.01,34.13 70.01,30.86 v69.95,30.8
  Bottom 0.2: v29.61,48.77 28.11,50.27 18.11,50.27 JP1.2 | v32.89,29.77 33.37,29.77 34.12,29.02 51.37,29.02 51.62,29.27 68.42,29.27 v69.95,30.8
N$4
  Bottom 0.2: R8.2 147.96,33.5 J3.SWITCH J3.PIN
N$5  (via drill 0.35)
  Top 0.2: v16.61,44.02 17.86,45.27 17.86,46.52 JP2.2
  Bottom 0.2: v16.61,44.02 16.36,43.77 10.87,43.77 8.37,46.27 4.62,46.27 4.62,72.02 10.37,77.77 20.11,77.77 32.62,90.27 147.12,90.27 147.12,86.14 150.62,82.64 150.62,72.77 153.62,69.77 153.62,66.77 152.37,65.52 152.37,57.77 153.37,56.77 153.62,56.77 153.62,53.52 152.37,52.27 152.37,49.27 153.62,48.02 154.62,48.02 154.62,43.27 152.87,41.52 141.12,41.52 138.12,44.52 IC2.30
N$6  (via drill 0.35)
  Top 0.152: v131.29,22.54 122.87,13.97 122.87,13.81 v122.71,13.81 | v129.7,26.19 129.7,26.83 v128.27,28.26
  Bottom 0.152: 101.86,11.02 105.72,11.02 106.22,10.52 107.14,10.52 107.25,10.64 122.71,10.64 v122.71,13.81 | v131.29,22.54 131.29,24.61 v129.7,26.19 | v128.27,28.26 128.27,31.43 IC2.14
  Bottom 0.2: 101.86,11.02 100.11,11.02 100.11,13.52 98.61,15.02 76.11,15.02 76.11,12.77 U$3.23
N$7
  Top 0.2: IC7.3 133.37,4.02 139.38,10.04 139.38,14.45 140.81,15.87 140.81,55.56 139.06,57.31 IC2.35 138.37,57.02
N$8
  Bottom 0.2: IC2.34 144.3,54.77 144.94,54.13 R10.1
N$9
  Bottom 0.2: IC2.31 140.81,47.15 R11.1
N$10
  Bottom 0.2: D2.A 147.64,46.99 R10.2
N$11
  Bottom 0.2: D3.A R11.2
N$14  (via drill 0.35)
  Top 0.2: U2.P14 78.74,38.42 v77.63,37.31 | v77.63,35.72 77.63,25.07 77.62,25.07 77.62,23.53 77.61,23.52 78.42,22.72 U$3.22
  Bottom 0.2: v77.63,37.31 v77.63,35.72
N$15  (via drill 0.35)
  Top 0.2: U$3.21 80.86,12.77 79.86,13.77 79.86,36.68 v79.55,37
  Bottom 0.2: U2.P15 76.7,39.85 v79.55,37
N$16
  Bottom 0.2: 109.06,20.32 C3.2 | Q1.2 109.06,20.32 | 109.06,20.32 109.06,19.01 C2.1 | U2.P39 109.22,20.48 109.06,20.32
N$17
  Bottom 0.2: J2.PIN J2.SWITCH 147.62,19.77 118.36,19.77 111.36,26.77 101.11,26.77 99.11,24.77 U2.P35
N$18  (via drill 0.35)
  Top 0.2: v86.61,54.02 86.61,53.77 84.66,53.77 83.82,54.61 v83.82,58.9 | v94.11,54.27 95.36,55.52 U3.5 | v109.61,47.27 109.61,42.02 111.61,40.02 U2.P1
  Bottom 0.2: v86.61,54.02 86.86,54.27 v94.11,54.27 | U3.5 95.61,55.27 96.61,54.27 103.52,54.27 104.46,53.34 105.09,53.34 105.89,52.55 105.89,51 v109.61,47.27 | 83.25,57.63 U1.5 | 83.25,57.63 83.27,57.63 | v83.82,58.9 83.5,58.9 83.34,58.74 83.34,57.72 83.25,57.63
N$20
  Bottom 0.2: D1.A R7.2
N$21  (via drill 0.35)
  Top 0.2: v101.07,62.82 103.11,60.77 103.11,60.52 U3.16 | 107.36,44.42 107.36,44.52 | 107.36,44.42 107.36,41.77 109.11,40.02 U2.P2 | 103.36,60.02 103.36,60.27 U3.16 | U3.16 103.98,60.48 108.27,56.2 108.27,47.78 107.31,46.83 107.31,44.47 107.36,44.42
  Bottom 0.2: v101.07,62.82 99.61,64.27 87.11,64.27 85.61,62.77 U1.16
N$23
  Top 0.2: IC2.15 122.86,34.52 124.86,36.52 124.86,47.52 122.86,49.52 IC2.9
N$24
  Bottom 0.2: J5.SWITCH J5.PIN 147.48,63.5 R1.2
N$37
  Bottom 0.2: IC6.1 11.87,11.02 8.62,14.27 5.62,14.27 5.12,14.77 5.12,23.27 10.37,23.27 11.37,22.27 U$1.P$1
N$39
  Bottom 0.2: IC6.3 17.36,11.02 19.11,12.77 20.36,12.77 22.11,11.02 IC6.5
N$40  (via drill 0.35)
  Top 0.2: v50.87,14.02 56.12,19.27 56.12,20.02 IC3.20
  Bottom 0.2: v50.87,14.02 50.62,14.27 24.86,14.27 24.86,11.02 IC6.6
N$41
  Bottom 0.2: IC6.13 14.62,18.52 17.11,18.52 IC6.12 17.36,18.77 18.86,20.27 25.61,20.27 27.11,18.77 IC6.8
N$64  (via drill 0.35)
  Top 0.2: v140.12,70.77 140.12,60.02 141.87,58.27 R5.1
  Bottom 0.2: v140.12,70.77 133.37,77.52 127.11,77.52 C27.-
N$94
  Bottom 0.2: R1.1 144.87,61.02 143.62,59.77 140.12,59.77 138.62,58.27 129.12,58.27 124.11,53.27 118.36,53.27 115.61,50.52 C1.-
N$99  (via drill 0.35)
  Top 0.2: 69.86,56.02 70.11,56.27 IC1.15 69.86,56.02 | 69.86,56.02 68.11,54.27 68.11,53.02 70.11,51.02 IC1.13 | 39.87,58.77 41.37,60.27 41.87,60.27 IC8.15 | 39.87,58.77 39.87,63.52 41.87,65.52 IC8.17 41.91,65.88 46.04,70.01 46.04,71.99 v46.08,72.02 | IC8.13 40.96,55.4 39.87,56.5 39.87,58.77 | v67.68,73.48 67.68,63.55 67.43,63.31 67.43,62.74 67.79,62.39 v67.79,61.12 | v67.79,58.74 67.79,58.1 69.86,56.02
  Bottom 0.2: 57.12,73.52 55.62,72.02 v46.08,72.02 | 57.12,73.52 60.12,76.52 RN1.8 | v67.68,73.48 67.63,73.52 57.12,73.52 | v67.79,58.74 v67.79,61.12 IC1.17
OUT*  (via drill 0.35)
  Top 0.2: v5.87,22.52 5.87,33.02 7.37,34.52 U$1.P$12 | v74.11,14.77 v69.36,14.77
  Bottom 0.152: 112.08,27.27 122.27,27.27 IC2.18
  Bottom 0.2: 101.11,15.52 101.11,17.02 97.86,20.27 97.86,27.27 112.08,27.27 112.11,27.27 | 101.11,15.52 101.11,12.77 U$3.13 | IC2.18 122.61,26.77 | v5.87,22.52 5.87,14.77 v69.36,14.77 | v74.11,14.77 74.86,15.52 101.11,15.52
RD_  (via drill 0.35)
  Top 0.2: v14.76,27.52 14.76,38.83 v14.5,39.09
  Bottom 0.2: 43.87,27.52 43.95,27.44 | 43.95,27.44 51.12,20.27 IC3.22 | 43.95,27.44 29.99,27.44 29.95,27.47 14.81,27.47 v14.76,27.52 | v14.5,39.09 12.19,39.09 U$1.P$15
RIGHT  (via drill 0.35)
  Top 0.2: JOYSTICK1.5 50.12,80.77 49.37,80.77 46.12,77.52 46.12,75.02 41.12,75.02 39.37,73.27 39.37,57.52 39.37,56.83 38.75,56.21 v38.75,55.96
  Bottom 0.2: JOYSTICK1.5 50.95,80.97 RN1.10 | IC8.8 38.2,55.4 v38.75,55.96
RIGHT1  (via drill 0.35)
  Top 0.2: v60.12,70.27 60.37,70.02 60.37,53.02 62.37,51.02 IC1.8
  Bottom 0.2: JOYSTICK2.5 81.93,80.97 79.48,78.52 77.31,78.52 76.53,77.74 76.53,75.62 75.96,75.05 72.63,75.05 71.88,75.79 | RN1.4 71,76.68 71.88,75.79 | v60.12,70.27 61.62,71.77 67.86,71.77 71.88,75.79
RTS*
  Top 0.2: IC2.32 137.87,49.77 135.87,51.77 135.87,78.27 145.62,88.02 145.62,88.27 J1.6
SIN
  Bottom 0.2: IC2.10 122.86,47.27 131.87,56.27 139.12,56.27 141.12,58.27 141.12,59.27 144.62,59.27 146.12,60.77 146.12,62.77 143.87,65.02 143.87,87.02 142.12,87.02 140.87,88.27 J1.4
SN76489-CLOCK  (via drill 0.35)
  Top 0.152: U2.P38 106.68,25.24 113.66,32.23 122.4,32.23 IC2.16
  Top 0.2: 55.62,40.52 60.12,45.02 60.12,50.27 57.62,52.77 57.62,61.02 56.12,62.52 55.62,62.52 U11.P14 | 55.62,40.52 U4.P14 | v103.36,28.02 106.61,24.77 U2.P38 | v61.94,34.46 61.94,35.22 61.28,35.88 61.28,37.78 60.64,38.42 59.05,38.42 57.15,40.32 55.82,40.32 55.62,40.52
  Bottom 0.2: v61.94,34.46 v61.94,34.45 63.5,34.45 65.09,32.86 83.82,32.86 84.14,32.54 88.27,32.54 88.42,32.7 98.69,32.7 v103.36,28.02
SND1_ENABLE_N  (via drill 0.35)
  Top 0.2: U11.P6 48.12,55.27 48.12,57.52 U11.P5 | v77.36,14.27 77.36,18.77 72.36,23.77 v72.36,34.88 | v44.64,42.23 44.64,46.7 44.93,46.99 44.93,49.21 44.61,49.53 44.61,51.27 v44.8,51.46
  Bottom 0.2: v77.36,14.27 77.61,14.52 81.61,14.52 83.36,12.77 U$3.20 | 46.62,55.02 47.87,55.02 U11.P6 45.24,55.09 45.09,54.93 45.09,51.75 v44.8,51.46 | v44.64,42.23 45.12,41.75 45.12,41.27 47.12,39.27 48.87,39.27 51.62,36.52 70.73,36.52 v72.36,34.88
SND1_READY  (via drill 0.35)
  Top 0.2: v49.37,51.52 49.62,51.77 49.62,58.52 48.12,60.02 U11.P4 | v43.87,48.02 40.12,44.27 40.12,41.52 R2.2 | IC6.9 24.76,29.37 25.08,29.69 25.08,30.48 24.45,31.11 24.45,40.74 v24.48,40.77
  Bottom 0.2: R2.2 39.87,41.27 39.37,40.77 v24.48,40.77 | v49.37,51.52 48.87,51.02 46.87,51.02 v43.87,48.02
SND2_ENABLE_N  (via drill 0.35)
  Top 0.2: 85.86,12.77 U$3.19 86.04,14.13 82.39,17.78 82.39,18.43 v82.29,18.52 | U4.P6 49.85,32.86 50.16,32.54 50.16,30.57 50.43,30.3 50.43,27.49 50.83,27.09 52.8,27.09 v53.12,26.77
  Bottom 0.2: U4.P6 48.12,33.02 48.12,35.27 U4.P5 | v53.12,26.77 56.62,26.77 56.87,27.02 74.86,27.02 74.86,24.27 75.86,23.27 76.26,23.27 80.96,18.57 82.24,18.57 v82.29,18.52
SND2_READY  (via drill 0.35)
  Top 0.2: 45.12,37.77 R6.2 45.09,32.07 44.62,31.6 v44.62,31.32 | v23.71,30.34 23.71,21.69 23.65,21.64 23.65,20.8 22.22,19.37 IC6.10
  Bottom 0.2: U4.P4 47.87,38.02 45.12,38.02 R6.2 | v44.62,31.32 43.82,30.52 43.82,30.33 42.92,29.43 34.28,29.43 33.25,30.45 25.58,30.45 25.56,30.48 23.84,30.48 v23.71,30.34
SNDOUT1  (via drill 0.35)
  Top 0.2: v59.37,74.27 53.37,68.27 53.37,55.11 52.84,54.59 52.84,52.8 52.68,52.64 v52.52,52.64
  Bottom 0.2: v59.37,74.27 60.12,75.02 60.87,75.02 61.37,75.52 61.37,88.77 112.36,88.77 114.11,87.02 114.11,77.77 124.36,77.77 C27.+ | U11.P7 49.92,52.55 50.58,53.2 51.15,53.2 51.71,52.64 v52.52,52.64
SNDOUT2  (via drill 0.35)
  Top 0.2: v49.62,26.27 49.62,28.77 48.12,30.27 U4.P7 | v114.11,45.52 113.11,46.52 113.11,50.27 C1.+ | v87.27,30.96 87.27,35.95 v87.23,36
  Bottom 0.2: v49.62,26.27 49.62,28.52 51.62,28.52 51.87,28.77 85.02,28.77 87.2,30.96 v87.27,30.96 | v114.11,45.52 114.11,40.52 109.41,35.82 109.41,35.83 88.3,35.83 88.13,36 v87.23,36
SOUT
  Bottom 0.2: IC2.11 122.86,44.77 126.36,48.27 142.37,48.27 144.62,46.02 145.37,46.02 146.37,47.02 146.37,48.77 148.87,48.77 150.12,50.02 150.12,53.02 149.62,53.52 149.62,57.02 150.12,57.52 150.12,66.27 149.62,66.77 149.62,70.02 150.12,70.52 150.02,70.62 150.02,72.87 146.87,76.02 146.87,84.77 143.37,88.27 J1.5
SYSRESET*  (via drill 0.35)
  Top 0.2: v74.36,10.52 96.61,10.52 98.61,12.52 U$3.14
  Bottom 0.2: v74.36,10.52 73.86,11.02 72.86,11.02 70.11,13.77 70.11,15.77 10.87,15.77 9.37,17.27 8.87,17.27 7.62,18.52 7.62,22.02 U$1.P$2
TMS9118_RW(*)_TMS4416_W(*)  (via drill 0.35)
  Top 0.2: v79.36,42.52 79.36,58.27 77.86,59.77 77.86,60.02 U1.4 | 90.61,43.02 v90.86,42.77 90.65,42.99 90.65,49.37 92.55,51.28 92.55,56.36 93.68,57.49 93.68,57.77 95.36,57.77 U3.4
  Bottom 0.2: v90.86,42.77 89.9,42.77 89.71,42.95 89.15,42.95 88.72,42.52 86.36,42.52 | 86.36,42.52 v79.36,42.52 | U2.P11 86.36,42.52
TMS9918_AD0-TMS4416_A7  (via drill 0.35)
  Top 0.2: U2.P10 88.9,40.32 88.27,40.96 88.27,44.33 v88.43,44.5 v88.43,46.18
  Bottom 0.2: U3.10 103.11,45.02 102.11,44.02 88.91,44.02 v88.43,44.5 | U1.10 87.15,47.47 v88.43,46.18
TMS9918_AD1-TMS4416_A6
  Top 0.2: U2.P9 91.61,40.02 91.61,43.16 91.11,43.66 91.11,48.27 95.36,52.52 95.36,52.77 U3.6
  Bottom 0.2: U1.6 77.86,55.02 79.11,53.77 85.86,53.77 86.61,53.02 95.36,53.02 U3.6
TMS9918_AD2-TMS4416_A5
  Top 0.2: U2.P8 94.11,40.02 94.11,48.77 95.36,50.02 95.36,50.27 U3.7
  Bottom 0.2: U1.7 77.86,52.52 79.11,51.27 94.61,51.27 95.36,50.52 U3.7
TMS9918_AD3-TMS4416_A4
  Top 0.2: U2.P7 96.61,40.02 97.11,40.52 97.11,46.02 95.61,47.52 95.61,47.77 U3.8
  Bottom 0.2: U1.8 77.86,49.77 78.86,48.77 94.61,48.77 95.36,48.02 U3.8
TMS9918_AD4-TMS4416_A3  (via drill 0.35)
  Top 0.2: v98.11,46.98 98.11,40.77 98.86,40.02 U2.P6
  Bottom 0.2: 98.11,49.02 102.11,49.02 103.11,48.02 U3.11 | 98.11,49.02 95.11,49.02 94.86,49.27 86.11,49.27 85.61,49.77 U1.11 | 98.11,49.02 v98.11,46.98
TMS9918_AD5-TMS4416_A2
  Top 0.2: U2.P5 101.61,40.02 101.61,48.52 103.11,50.02 103.11,50.27 U3.12
  Bottom 0.2: U1.12 85.61,52.52 86.36,51.77 94.86,51.77 95.11,51.52 102.11,51.52 103.11,50.52 U3.12
TMS9918_AD6-TMS4416_A1
  Top 0.2: 104.23,39.92 104.36,40.02 | 104.23,39.92 U2.P4 | 104.23,39.92 104.62,40.3 104.62,51.59 103.66,52.55 103.5,52.55 U3.13
  Bottom 0.2: U1.13 85.61,55.02 94.36,55.02 95.36,54.02 96.11,54.02 97.11,53.02 103.11,53.02 U3.13
TMS9918_AD7-TMS4416_A0  (via drill 0.35)
  Top 0.2: v86.61,56.02 86.61,56.52 85.61,57.52 U1.14 | v97.59,55.55 97.11,56.02 97.11,56.52 94.14,56.52 v93.57,55.96 | U2.P3 106.68,40.8 106.2,41.27 106.2,44.77 106.52,45.08 106.52,47.62 107,48.1 v107,52
  Bottom 0.2: 97.72,55.52 103.11,55.52 U3.14 103.36,55.27 104.36,54.27 105.59,54.27 107,52.86 v107,52 | 97.72,55.52 97.61,55.52 | v97.59,55.55 97.7,55.55 97.72,55.52 | v86.61,56.02 93.5,56.02 v93.57,55.96
TRIGGER  (via drill 0.35)
  Top 0.2: v50.37,72.77 44.37,66.77 44.37,66.75 43.97,66.36 43.97,64.93 44.77,64.13 44.77,61.44 44.45,61.12 44.45,60.48 44.61,60.32 44.61,60.01 44.77,59.85 44.77,53.18 44.37,52.78 44.37,52.77 42.12,50.52 IC8.11
  Bottom 0.2: JOYSTICK1.9 50.65,83.81 RN1.9 57.62,76.52 56.12,75.02 52.62,75.02 v50.37,72.77
TRIGGER1
  Top 0.2: IC1.11 70.36,46.02 72.39,48.05 72.39,64.04 73.2,64.85 73.2,67.81 72.36,68.64 72.36,70.93 71.86,71.43 71.86,74.52 72.86,75.52 72.86,76.52 RN1.3
  Bottom 0.2: RN1.3 75.27,78.92 79.31,78.92 80.85,80.46 80.85,83.67 JOYSTICK2.9
UP
  Bottom 0.2: JOYSTICK1.2 43.01,80.97 44.25,79.73 44.57,79.73 RN1.13 47.62,76.52 43.12,72.02 40.87,72.02 38.62,74.27 32.62,74.27 32.62,72.27 34.12,70.77 IC8.2
UP1
  Top 0.2: RN1.7 62.87,75.52 60.87,73.52 60.87,67.77 62.37,66.27 IC1.2
  Bottom 0.2: JOYSTICK2.2 73.6,80.97 72.36,82.21 68.4,82.21 RN1.7
VCC  (via drill 0.35)
  Top 0.2: v44.37,71.27 42.62,73.02 42.12,73.02 IC8.20 | IC6.14 12.37,18.27 12.37,13.02 14.37,11.02 IC6.2 | v42.62,24.27 42.62,34.27 R9.2 | C21.1 92.61,45.02 92.61,26.27 93.86,25.02 93.86,24.77 U2.P33 | C14.1 73.36,72.02 75.61,69.77 75.61,48.77 74.36,47.52 C15.1
  Bottom 0.2: IC3.28 C7.1 36.12,23.77 42.12,23.77 v42.62,24.27 | C12.1 9.37,18.57 IC6.14 12.12,18.77 14.12,20.77 35.87,20.77 IC3.28 | IC5.20 C10.1 32.62,46.77 39.21,46.77 | IC8.20 C13.1 40.73,76.99 39.77,77.96 29.83,77.96 C6.1 27.15,79.69 IC4.20 | 71.16,69.73 73.34,71.91 C14.1 73.44,72.23 | 71.16,69.73 IC1.20 | 73.44,72.23 73.66,72.23 | C15.1 U1.9 77.86,47.27 79.86,45.27 92.61,45.27 C21.1 U3.9 95.61,45.27 98.36,45.27 99.61,46.52 108.11,46.52 108.36,46.27 Q2.C 108.61,46.27 109.61,46.27 111.36,48.02 120.61,48.02 120.61,44.27 122.61,42.27 IC2.12 122.86,42.02 122.86,39.77 IC2.13 | U4.P16 C17.1 | IC2.40 C18.1 | IC2.39 IC2.40 | REG1.P$3 114.62,85.25 C4.+ | C4.+ 118.11,82.07 R7.1 123.22,87.18 126.09,87.18 126.81,87.91 126.81,88.88 127.6,89.67 136.09,89.67 137.33,88.42 J1.3 | 73.44,72.23 75.86,74.65 76.13,74.65 76.93,75.45 76.93,75.5 RN1.1 78.11,76.52 84.61,70.02 102.11,70.02 103.36,71.27 120.11,71.27 125.86,77.02 | U2.P33 C16.1 93.86,22.27 89.36,17.77 74.36,17.77 73.86,17.27 | R9.2 R6.1 R2.1 42.62,41.52 42.55,41.59 42.55,46.67 | 125.86,77.02 125.61,77.27 125.61,81.52 118.11,81.52 C4.+ | 125.86,77.02 126.36,76.52 131.37,76.52 137.87,70.02 IC2.40 | 71.16,69.73 71.11,69.77 60.62,69.77 58.87,68.02 C20.1 U11.P16 55.37,68.02 52.12,71.27 v44.37,71.27 | 55.37,45.52 U4.P16 | 39.37,46.77 39.21,46.77 | 73.86,17.27 73.36,16.77 C8.1 U$3.24 73.36,12.52 74.86,11.02 84.36,11.02 85.86,9.52 119.72,9.52 127.22,2.02 128.37,2.02 129.87,3.52 IC7.2 127.79,6.35 IC7.14 C11.1 | 73.86,17.27 38.87,17.27 36.12,20.02 IC3.28 | 39.21,46.77 42.44,46.77 42.55,46.67 | 42.55,46.67 54.45,46.67 U4.P16
VDP-RD0  (via drill 0.35)
  Top 0.2: U1.2 77.86,65.02 80.49,62.4 80.49,41.75 80.11,41.38 80.11,38.77 80.17,38.72 80.17,38.1 82.05,36.22 v82.05,26.48
  Bottom 0.2: U2.P32 91.12,24.61 89.38,26.35 82.17,26.35 v82.05,26.48
VDP-RD1  (via drill 0.35)
  Top 0.2: v74.86,28.02 74.86,46.02 76.11,47.27 76.11,60.77 77.61,62.27 77.61,62.52 U1.3
  Bottom 0.2: v74.86,28.02 77.36,28.02 77.36,24.27 78.36,23.27 87.61,23.27 88.86,24.52 U2.P31
VDP-RD2  (via drill 0.35)
  Top 0.2: U1.15 82.87,60.17 82.87,57.28 82.86,57.27 82.86,47.77 85.11,45.52 85.13,45.52 v86.2,44.45 | U2.P30 86.36,27.62 85.09,28.89 85.09,34.45 84.77,34.77 84.77,35.72 85.11,36.06 85.11,43 v83.66,44.45
  Bottom 0.2: v86.2,44.45 v83.66,44.45
VDP-RD3  (via drill 0.35)
  Top 0.2: U1.17 85.36,65.27 82.36,62.27 82.36,62.2 81.6,61.44 81.6,42.79 v82.61,41.77 | v82.64,37.36 82.96,37.36 83.03,37.29 83.03,27.3 83.82,26.51 U2.P29
  Bottom 0.2: v82.61,41.77 82.61,37.71 82.64,37.68 v82.64,37.36
VDP-RD4  (via drill 0.35)
  Top 0.2: U3.2 95.36,63.02 95.36,62.52 89.61,56.77 89.61,42.77 89.43,42.59 v89.43,42.27 | U2.P28 81.28,25.4 80.96,25.72 v80.96,35.77
  Bottom 0.2: 81.11,35.77 v80.96,35.77 84.11,35.77 87.61,39.27 87.61,40.46 v89.43,42.27
VDP-RD5  (via drill 0.35)
  Top 0.2: v89.84,31.25 90.11,31.52 90.11,50.4 91.28,51.56 91.28,56.67 95.09,60.48 U3.3
  Bottom 0.2: v89.84,31.25 86.86,28.27 82.36,28.27 78.86,24.77 U2.P27
VDP-RD6  (via drill 0.35)
  Top 0.2: U3.15 103.11,57.77 103.11,57.52 100.36,54.77 100.36,33.69 v97.79,31.11 | v93.36,26.77 93.45,26.77 v95.73,29.05
  Bottom 0.2: v93.36,26.77 92.61,26.77 92.61,24.02 91.36,22.77 78.11,22.77 76.36,24.52 U2.P26 | v95.73,29.05 v97.79,31.11
VDP-RD7  (via drill 0.35)
  Top 0.2: v76.09,35.02 76.09,27.04 U2.P25 | v99.18,42.07 99.22,42.1 99.22,49.69 98.86,50.04 98.86,62.67 100.65,64.45 101.76,64.45 U3.17
  Bottom 0.2: v76.09,35.02 76.1,35.04 77.91,35.04 77.96,35.08 84.61,35.08 88.26,38.73 96.98,38.73 97.64,39.38 97.64,40.52 v99.18,42.07
VDP_MODE  (via drill 0.35)
  Top 0.2: v87.61,14.27 85.11,16.77 85.11,23.63 85.09,23.65 85.09,26.83 84.3,27.62 84.3,34.13 83.86,34.56 83.86,37.77 81.86,39.77 81.36,39.77 U2.P13
  Bottom 0.2: v87.61,14.27 87.86,14.52 91.86,14.52 93.61,12.77 U$3.16
VID_RESET*
  Top 0.2: U$3.15 96.36,12.77 96.36,24.52 U2.P34
  Bottom 0.2: R9.1 40.12,34.27 41.87,32.52 46.12,32.52 46.74,31.9 56.62,31.9 56.84,32.11 62.04,32.11 62.13,32.02 94.34,32.02 94.46,31.91 94.46,29.36 95.44,28.37 95.45,28.37 96.52,27.3 96.52,24.66 96.49,24.63 | 96.49,24.63 96.36,24.77 | 96.49,24.63 U2.P34 | IC7.1 127.36,4.02 121.36,10.02 98.86,10.02 96.36,12.52 U$3.15
VOLTAGE-IN
  Bottom 0.508: S1.1 110.3,73.5 C5.+ 109.54,74.64 REG1.P$1
WAIT*  (via drill 0.35)
  Top 0.2: U$1.P$33 11.37,62.52 11.37,62.27 9.87,60.77 9.87,20.46 v10,20.32 | IC6.11 v19.68,21.75
  Bottom 0.2: v10,20.32 10.61,20.92 12.39,20.92 13.22,21.75 v19.68,21.75
WR_  (via drill 0.35)
  Top 0.2: v12.37,33.52 12.62,33.77 12.62,35.77 11.62,36.77 11.62,37.27 U$1.P$13 | IC3.27 38.42,28.47 v36.09,30.8
  Bottom 0.2: v36.09,30.8 33.87,33.02 12.87,33.02 v12.37,33.52
XTAL1
  Bottom 0.2: C9.2 117.95,16.67 Q1.1 111.76,22.86 U2.P40
(copper drawn outside any net)
  shapes: Bottom area x2, Top area x2

## Text on the board
tNames: GND | CTS* | VCC | SOUT | +9V IN | SIN | RTS* | 5V REG | In | Out | 330 | 10uf | 10uf | 4.7k | TRS-80 Model 1 / Game Card-V4.0 / Joe Rounceville | AUD 1 | 74LS244 | 150k | AUD 2 | VDP INTERRUPT | 10uf | 74LS244 | SN76489 | 1.5k | TMS4416 | 74LS244 | TMS4416 | 470 | 2N2222 | 470 | 2k | Lum | 400 | 2k | UART (TL16C550C) | 4.7k | TMS9918 VDP | UART INTERRUPT | 75 | SN76489 | VID OUT | 74LS244 | 1M | ~10.7mhz | VID IN | 470 | 74LS00 | 0-60pf | 33pf | 33pf | 62256 SRAM | 74LS00 | DECODER
tValues: VIN | VCC